# EAGLE schematic schematic (EAGLE 9.0.1)
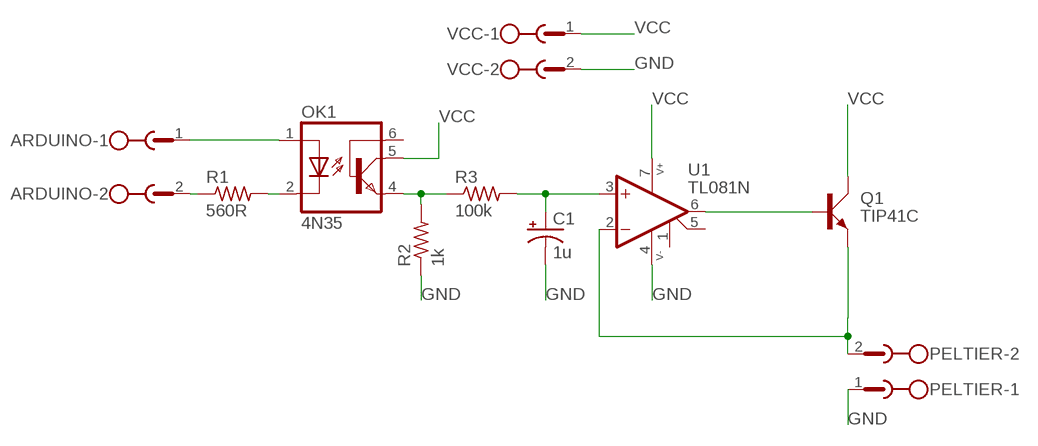
[diagram p0: schematic, sheet 1]

## Parts
ARDUINO  MSTBV2  [MSTBV2]
C1  1u  CPOL-USE2.5-7  [E2,5-7]
OK1  4N35  [DIL06]
PELTIER  MST2V  [MSTBV2]
Q1  TIP41C  [TO220AV]
R1  560R  R-US_0207/10  [0207/10]
R2  1k  R-US_0207/10  [0207/10]
R3  100k  R-US_0207/10  [0207/10]
U1  TL081N  [DIL08]
VCC  MSTBV2  [MSTBV2]

## Nets
GND: C1.- PELTIER.1 R2.1 U1.4(P:V-) VCC.2
N$1: ARDUINO.2 R1.1
N$2: OK1.2(C) R1.2
N$3: ARDUINO.1 OK1.1(A)
N$4: OK1.4(EMI) R2.2 R3.1
N$5: C1.+ R3.2 U1.3(A:+IN)
N$6: Q1.B U1.6(A:OUT)
N$7: PELTIER.2 Q1.E U1.2(A:-IN)
VCC: OK1.5(COL) Q1.C U1.7(P:V+) VCC.1
Unconnected: OK1.6(BAS) U1.1(-NULL:NULL1) U1.5(-NULL:NULL2)

## Library data of the parts
ARDUINO VCC = con-phoenix-508:MSTBV2: PHOENIX; MPN: MSTBV 2,5/2-GF-5.08; OC_FARNELL: 1792792; OC_NEWARK: 69R9845
C1 = resistor:CPOL-US: POLARIZED CAPACITOR, American symbol
OK1 = optocoupler:4N35: MOTOROLA OPTO COUPLER; MF: FAIRCHILD SEMICONDUCTOR; MPN: 4N35; OC_FARNELL: 1328375; OC_NEWARK: 72K9946
PELTIER = con-phoenix-508:MST2V: PHOENIX; OC_FARNELL: unknown; OC_NEWARK: unknown
Q1 = transistor-power:TIP41C: NPN TRANSISTOR
R1-R3 = resistor:R-US_: RESISTOR, American symbol
U1 = op-amp:TL081: JFET OP-AMP